# EAGLE design komblinkin (EAGLE 6.6.0)
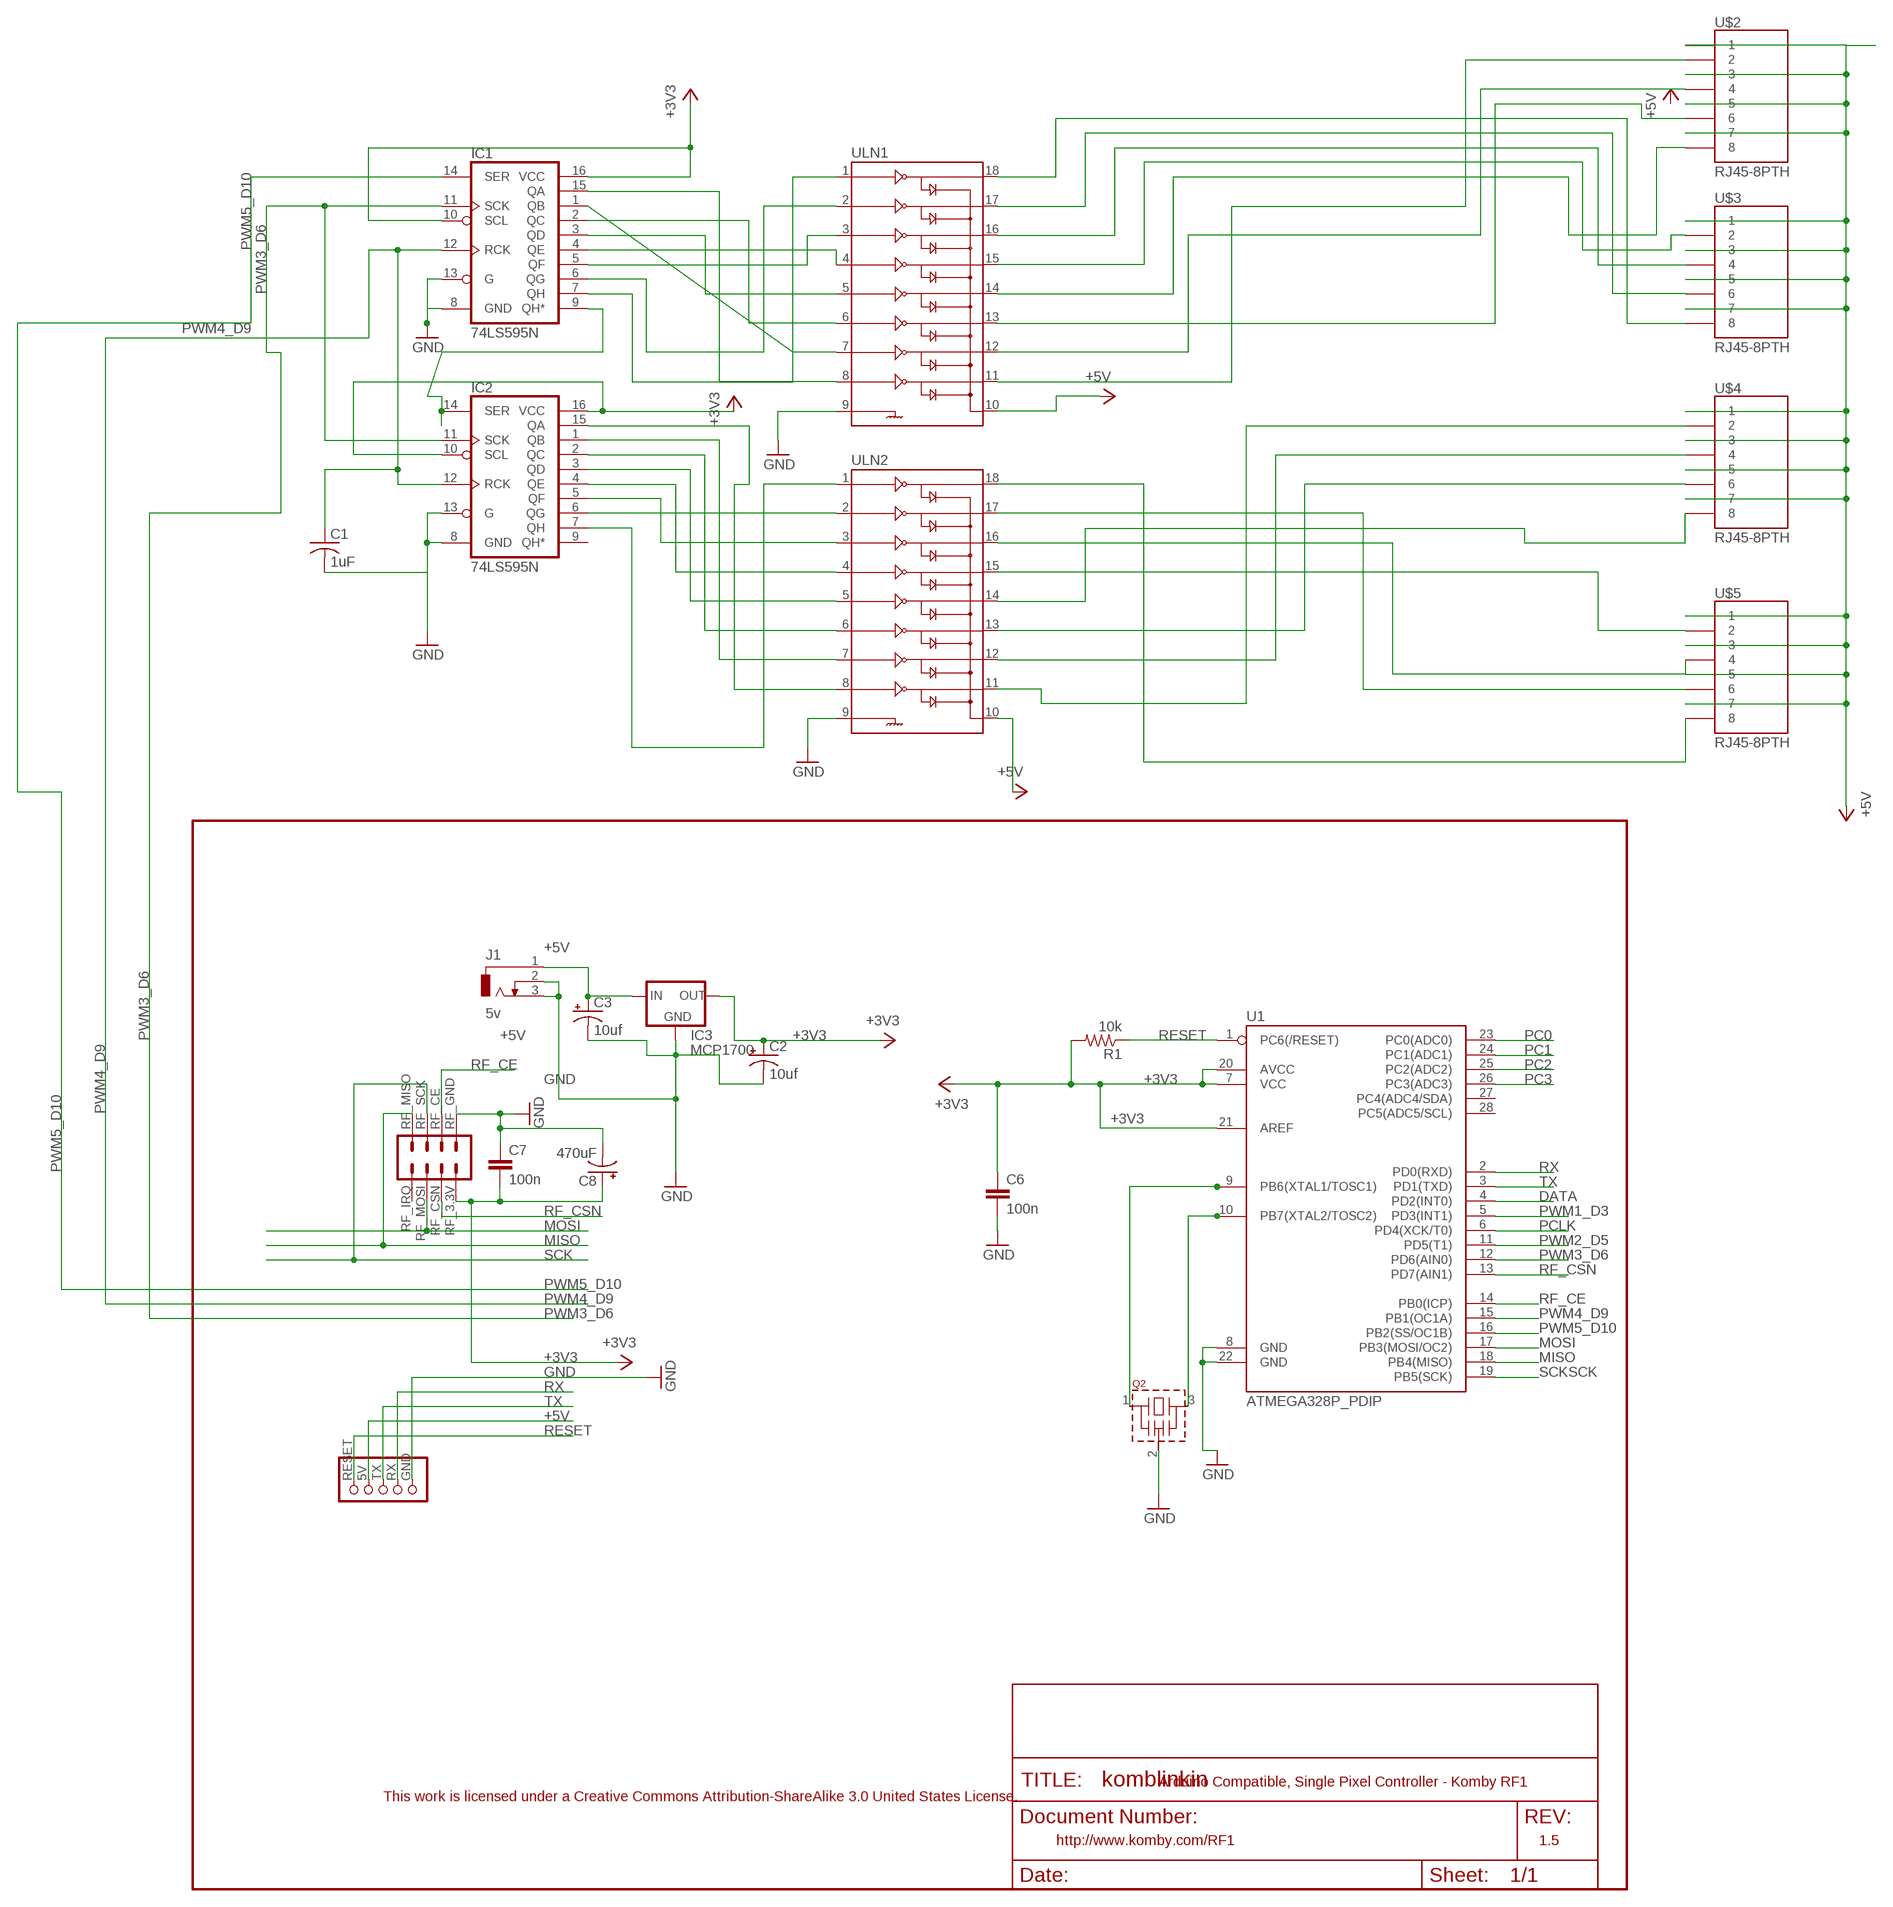
[diagram p0: schematic, sheet 1]

## Parts
C1  1uF  C-US050-025X075  [C050-025X075]
C2  10uf  CPOL-USE1.8-4  [E1,8-4]
C3  10uf  CPOL-USE5-8.5  [E5-8,5]
C6  100n  C-EU025-024X044  [C025-024X044]
C7  100n  C-EU025-024X044  [C025-024X044]
C8  470uF  CPOL-USE5-8.5  [E5-8,5]
IC1  74LS595N  [DIL16]
IC2  74LS595N  [DIL16]
IC3  MCP1700  MCP1700TRI  [TO92]
J1  5v  DCJ0303  [DCJ0303]
Q2  CSTLS_X  [CSTLS_X]
R1  10k  R-US_0207/7  [0207/7]
U1  ATMEGA328P_PDIP  [DIL28-3]
U$1  KOMBY_TTL_SERIAL  [KOMBY_SERIAL_FOOTPRINT]
U$2  RJ45-8PTH  [RJ45-8]
U$3  RJ45-8PTH  [RJ45-8]
U$4  RJ45-8PTH  [RJ45-8]
U$5  RJ45-8PTH  [RJ45-8]
U$8  NRF24L01_HEADER  [NRF24L01]
ULN1  ULN2803DIP  [DIL18]
ULN2  ULN2803DIP  [DIL18]

## Nets
+3V3: C2.+ C6.1 C7.2 C8.+ IC1.10(SCL) IC1.16(VCC) IC2.10(SCL) IC2.16(VCC) IC3.3(OUT) R1.2 U1.7(VCC) U1.20(AVCC) U1.21(AREF) U$8.RF_3.3V
+5V: C3.+ IC3.2(IN) J1.1 U$1.5V U$2.1 U$2.3 U$2.5 U$2.7 U$3.1 U$3.3 U$3.5 U$3.7 U$4.1 U$4.3 U$4.5 U$4.7 U$5.1 U$5.3 U$5.5 U$5.7 ULN1.10 ULN2.10
DATA: U1.4(PD2(INT0))
GND: C1.2 C2.- C3.- C6.2 C7.1 C8.- IC1.8(GND) IC1.13(G) IC2.8(GND) IC2.13(G) IC3.1(GND) J1.2 J1.3 Q2.2(VSS) U1.8(GND) U1.22(GND) U$1.GND U$8.RF_GND(RFGND_1) ULN1.9 ULN2.9
MISO: U1.18(PB4(MISO)) U$8.RF_MISO
MOSI: U1.17(PB3(MOSI/OC2)) U$8.RF_MOSI
N$1: U$5.8 ULN2.18
N$5: IC1.15(QA) ULN1.8
N$6: IC1.1(QB) ULN1.7
N$7: U$3.8 ULN1.18
N$8: IC1.2(QC) ULN1.6
N$9: IC1.3(QD) ULN1.5
N$10: IC1.4(QE) ULN1.4
N$11: IC1.5(QF) ULN1.3
N$12: IC1.9(QH*) IC2.14(SER)
N$13: IC1.6(QG) ULN1.2
N$14: U$3.6 ULN1.17
N$15: IC1.7(QH) ULN1.1
N$16: Q2.3 U1.10(PB7(XTAL2/TOSC2))
N$17: IC2.1(QB) ULN2.7
N$18: IC2.2(QC) ULN2.6
N$19: U$3.4 ULN1.16
N$20: IC2.3(QD) ULN2.5
N$21: IC2.4(QE) ULN2.4
N$22: IC2.5(QF) ULN2.3
N$23: IC2.6(QG) ULN2.2
N$24: IC2.7(QH) ULN2.1
N$25: U$3.2 ULN1.15
N$26: U$5.6 ULN2.17
N$27: U$5.4 ULN2.16
N$28: U$5.2 ULN2.15
N$29: U$4.8 ULN2.14
N$30: U$4.6 ULN2.13
N$31: U$4.4 ULN2.12
N$32: U$4.2 ULN2.11
N$33: IC2.15(QA) ULN2.8
N$34: Q2.1 U1.9(PB6(XTAL1/TOSC1))
N$35: U$2.8 ULN1.14
N$36: U$2.6 ULN1.13
N$37: U$2.4 ULN1.12
N$38: U$2.2 ULN1.11
PC0: U1.23(PC0(ADC0))
PC1: U1.24(PC1(ADC1))
PC2: U1.25(PC2(ADC2))
PC3: U1.26(PC3(ADC3))
PCLK: U1.6(PD4(XCK/T0))
PWM1_D3: U1.5(PD3(INT1))
PWM2_D5: U1.11(PD5(T1))
PWM3_D6: IC1.11(SCK) IC2.11(SCK) U1.12(PD6(AIN0))
PWM4_D9: C1.1 IC1.12(RCK) IC2.12(RCK) U1.15(PB1(OC1A))
PWM5_D10: IC1.14(SER) U1.16(PB2(SS/OC1B))
RESET: R1.1 U1.1(PC6(/RESET)) U$1.RESET
RF_CE: U1.14(PB0(ICP)) U$8.RF_CE
RF_CSN: U1.13(PD7(AIN1)) U$8.RF_CSN
RX: U1.2(PD0(RXD)) U$1.RX
SCK: U1.19(PB5(SCK)) U$8.RF_SCK
TX: U1.3(PD1(TXD)) U$1.TX
Unconnected: IC2.9(QH*) U1.27(PC4(ADC4/SDA)) U1.28(PC5(ADC5/SCL)) U$8.RF_IRQ

## Notes on the sheet
- Arduino Compatible, Single Pixel Controller - Komby RF1
- This work is licensed under a Creative Commons Attribution-ShareAlike 3.0 United States License.
- http://www.komby.com/RF1 | 1.5

## Library data of the parts
C1 = adafruit:C-US: CAPACITOR, American symbol
C2 C3 C8 = adafruit:CPOL-US: POLARIZED CAPACITOR, American symbol
C6 C7 = resistor:C-EU: CAPACITOR, European symbol
IC1 IC2 = SparkFun-DigitalIC:74*595: 8-bit SHIFT REGISTER, output latch
IC3 = adafruit:MCP1700: VOLTAGE REGULATOR
J1 = con-jack_komby:DCJ0303: DC POWER JACK Source: DCJ0303.pdf; OC_FARNELL: unknown; OC_NEWARK: unknown
Q2 = murata-resonators:CSTLS_X: Ceramic resonator 16.00 to 70.00 MHz
R1 = adafruit:R-US_: RESISTOR, American symbol
U1 = SparkFun-DigitalIC:ATMEGA328P_PDIP: uC used in the Arduino 32kb flash, 1k EEPROM, 2k SRAM This is the through-hole version of this chip.
U$1 = komby1:KOMBY_TTL_SERIAL
U$2-U$5 = SparkFun-Connectors:RJ45-8: RJ45 Jack Simple RJ45, 8-pin connection - connector for common Cat5, Cat5e, and Cat6 Ethernet cables. Footprint not yet proven in production. Connector sku is PRT-00643; Breakout PCB sku is BOB-00716.
U$8 = komby1:NRF24L01_HEADER: Header for the NRF24L01 8 Pin Transceivers. http://www.komby.com
ULN1 ULN2 = SparkFun-PowerIC:ULN2803: Darlington Driver ULN2803 Darlington array. 500mA max per channel, 8-channel package. Spark Fun Electronics SKU : COM-00312

## Net classes
0 default: width 0.203 mm
1 vcc: width 0.305 mm

## Board
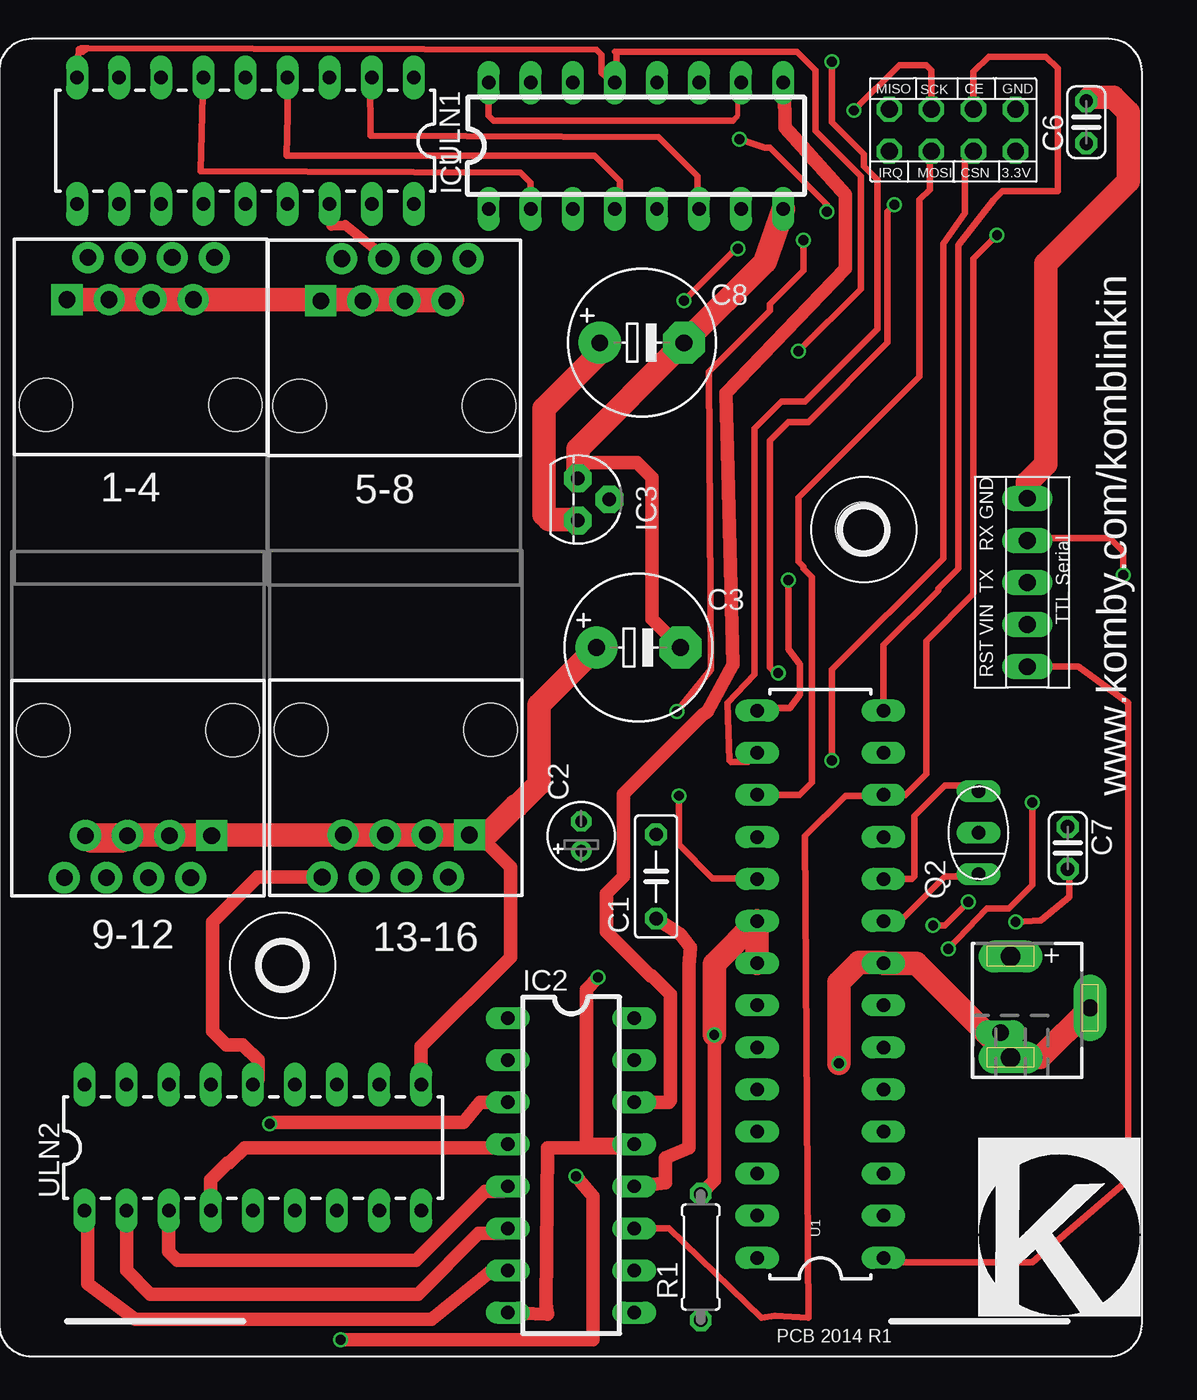
[diagram p1: board, top side]
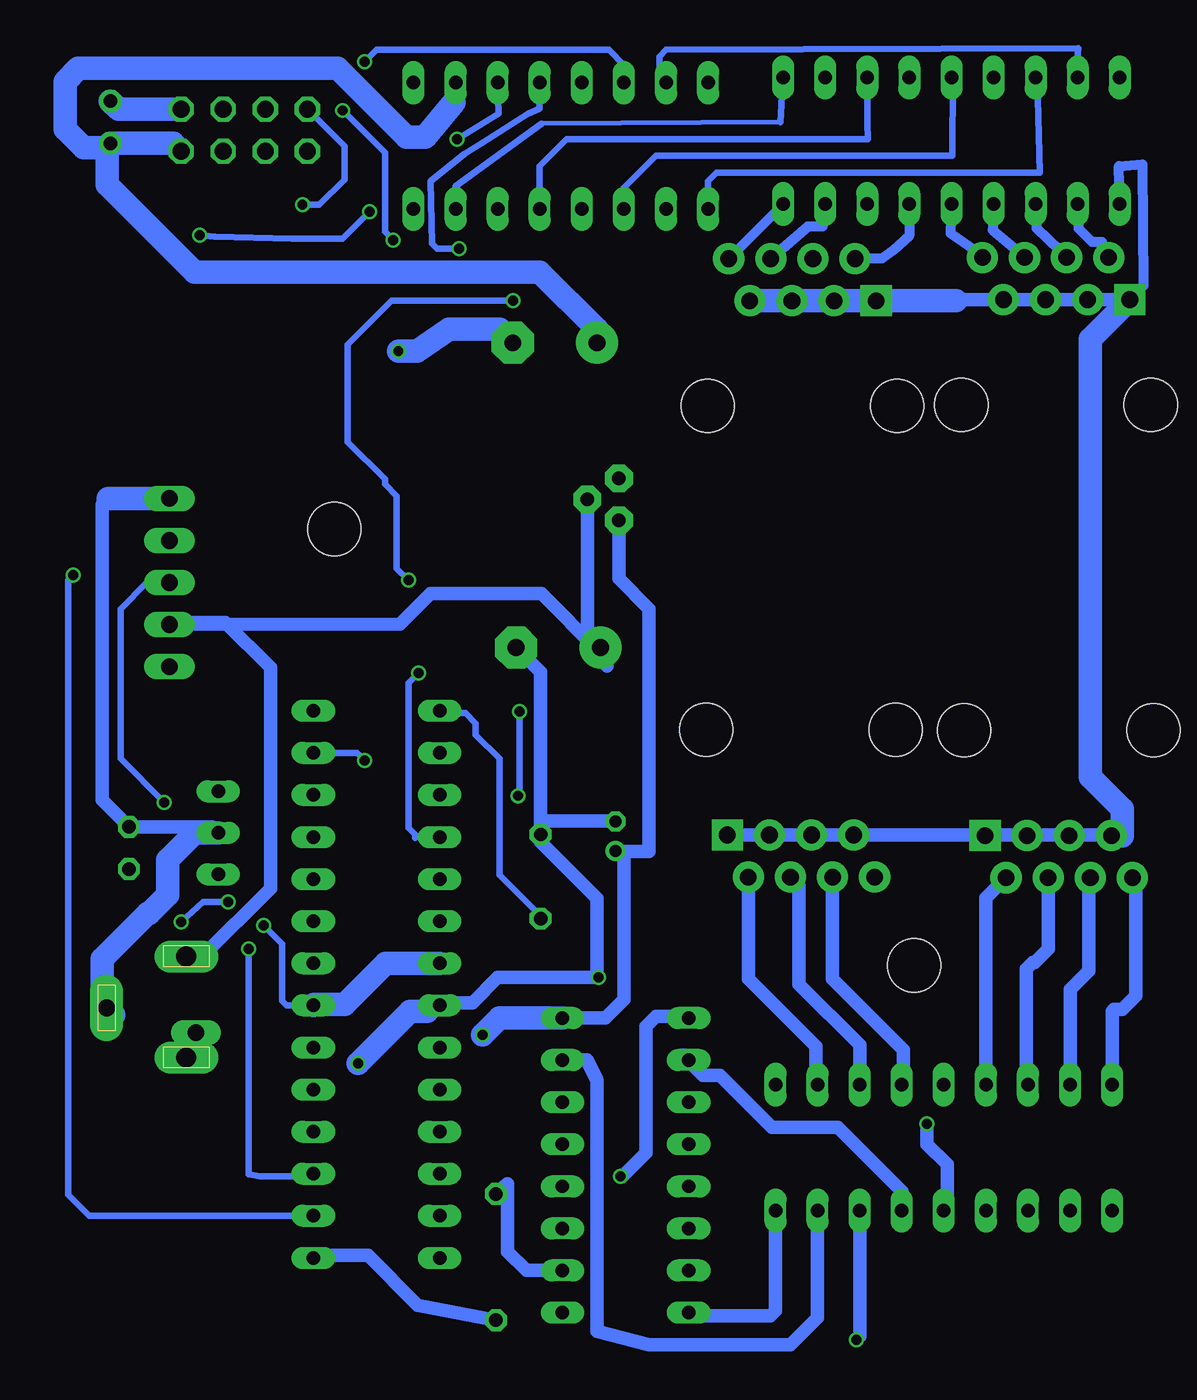
[diagram p2: board, bottom side, seen from below]

No outline drawn. Coordinates in mm, seen from the top.
Copper layers (1*16): Top 0.035mm / dielectric 1.5mm / Bottom 0.035mm
Design rules "Fusion_eagle_rule_v1.1": minimum track width 6mil, minimum drill 12mil, track to track 6mil, track to pad 6mil, pad to pad 6mil, via to via 6mil, smd to smd 0mil, copper to edge 10mil, drill to drill 10mil, minimum pad ring 10mil, minimum via ring 6mil, stop-mask expansion 2mil, vias tented up to drill 100mil, thermal gap 10mil

### Footprints (pad centres in the part's own frame; a part is rotated, then mirrored left to right if it is on the bottom)
C050-025X075 = drill 0.813 octagon: 1 -2.54,0; 2 2.54,0
E1,8-4 = drill 0.711 pad 1.168: + -0.889,0 | drill 0.711 pad 1.168 octagon: - 0.889,0
E5-8,5 = drill 1.016 pad 2.54: + -2.54,0 | drill 1.016 pad 2.54 octagon: - 2.54,0
C025-024X044 = drill 0.813 octagon: 1 -1.27,0; 2 1.27,0
DIL16 = drill 0.813 long: 1 -8.89,-3.81; 2 -6.35,-3.81; 3 -3.81,-3.81; 4 -1.27,-3.81; 5 1.27,-3.81; 6 3.81,-3.81; 7 6.35,-3.81; 8 8.89,-3.81; 9 8.89,3.81; 10 6.35,3.81; 11 3.81,3.81; 12 1.27,3.81; 13 -1.27,3.81; 14 -3.81,3.81; 15 -6.35,3.81; 16 -8.89,3.81
TO92 = drill 0.813 pad 1.676 octagon: 1 -1.27,0; 2 0,1.905; 3 1.27,0
DCJ0303 = drill 1.2 pad 1.93 long: 1 0,3.1; 3 0,-3 | drill 1 pad 2 long: 2 4.8,0 | drill 1 long: P$1 -0.589,-1.501
CSTLS_X = drill 0.813 long: 1 -2.5,0; 2 0,0; 3 2.5,0
0207/7 = drill 0.813 octagon: 1 -3.81,0; 2 3.81,0
DIL28-3 = drill 0.813 long: 1 -16.51,-3.81; 2 -13.97,-3.81; 3 -11.43,-3.81; 4 -8.89,-3.81; 5 -6.35,-3.81; 6 -3.81,-3.81; 7 -1.27,-3.81; 8 1.27,-3.81; 9 3.81,-3.81; 10 6.35,-3.81; 11 8.89,-3.81; 12 11.43,-3.81; 13 13.97,-3.81; 14 16.51,-3.81; 15 16.51,3.81; 16 13.97,3.81; 17 11.43,3.81; 18 8.89,3.81; 19 6.35,3.81; 20 3.81,3.81; 21 1.27,3.81; 22 -1.27,3.81; 23 -3.81,3.81; 24 -6.35,3.81; 25 -8.89,3.81; 26 -11.43,3.81; 27 -13.97,3.81; 28 -16.51,3.81
KOMBY_SERIAL_FOOTPRINT = drill 1.016 long: 5V 3.25,3.925; GND 3.25,11.545; RESET 3.25,1.385; RX 3.25,9.005; TX 3.25,6.465
RJ45-8 = drill 1 pad 1.88 square: 1 -4.445,6.35 | drill 1 pad 1.88: 2 -3.175,8.89; 3 -1.905,6.35; 4 -0.635,8.89; 5 0.635,6.35; 6 1.905,8.89; 7 3.175,6.35; 8 4.445,8.89 | hole 3.2: -5.715,0; 5.715,0
TA200FTPRNT = hole 3.2: 52.126,49.918; 17.128,23.595
NRF24L01 = drill 1.016 octagon: RF_3.3V 2.54,-0.635; RF_CE 0,1.905; RF_CSN 0,-0.635; RF_GND 2.54,1.905; RF_IRQ -5.08,-0.635; RF_MISO -5.08,1.905; RF_MOSI -2.54,-0.635; RF_SCK -2.54,1.905
DIL18 = drill 0.813 long: 1 -10.16,-3.81; 2 -7.62,-3.81; 3 -5.08,-3.81; 4 -2.54,-3.81; 5 0,-3.81; 6 2.54,-3.81; 7 5.08,-3.81; 8 7.62,-3.81; 9 10.16,-3.81; 10 10.16,3.81; 11 7.62,3.81; 12 5.08,3.81; 13 2.54,3.81; 14 0,3.81; 15 -2.54,3.81; 16 -5.08,3.81; 17 -7.62,3.81; 18 -10.16,3.81

### Placement (x,y rotation side)
C1  39.78,28.85 90 top
C2  35.26,31.29 90 top
C3  38.71,42.67 0 top
C6  65.74,74.37 90 top
C7  64.62,30.58 270 top
C8  38.91,61.06 0 top
IC1  38.56,72.95 0 top
IC2  34.65,11.43 270 top
IC3  35.05,51.61 270 top
J1  61.16,20.93 0 top
Q2  59.23,31.5 90 top
R1  42.47,5.89 90 top
U1  49.68,22.35 90 top
U$1  58.93,40.13 0 top
U$2  8.67,57.31 0 top
U$3  23.98,57.25 0 top
U$4  24.06,37.71 180 top
U$5  8.51,37.67 180 top
U$6  [TA200FTPRNT]  0.1,-0.1 0 top
U$7  [KOMBY_LOGO_1CMX1CM]  59.23,2.34 0 top
U$8  58.93,73.25 0 top
ULN1  14.99,73.25 180 top
ULN2  15.44,12.5 0 top

### Tracks (layer width: path | path; a pad name or v marks a point on that pad's centre or on a via)
+3V3  (via drill 0.6)
  Top 0.305: 44.4,74.47 44.7,74.78 44.7,76.56
  Top 0.406: IC1.16 29.67,74.78 29.97,74.47 44.4,74.47 | 44.7,76.56 IC1.10 | v56.49,25.91 57.2,25.91 v58.62,27.33 | v61.47,26.11 62.99,26.21 64.72,27.64 64.72,29.21 C7.2
  Top 0.813: 33.02,50.7 33.33,50.39 | 35,50.39 IC3.3 | v43.28,19.3 43.28,10.52 R1.2
  Top 1.422: C8.+ 36.37,60.45 33.02,57.1 33.02,50.7 | 33.33,50.39 35,50.39 | U1.21 U1.20 43.28,23.57 v43.28,19.3
  Bottom 0.406: IC1.10 45.01,75.59 | 65.99,72.85 C6.1 | U1.7 55.12,21.08 55.37,21.34 55.37,24.79 v56.49,25.91 | v58.62,27.33 60.15,27.33 v61.47,26.11
  Bottom 0.813: IC3.3 35.05,46.84 33.22,45.01 33.22,30.38 35.23,30.38 C2.+ 34.75,29.9 34.75,21.44 35.87,20.32 IC2.16 | IC2.10 40.64,5.08 41.76,6.2 41.76,10.31 R1.2
  Bottom 1.422: 45.01,75.59 46.74,73.46 47.85,73.46 52.02,77.62 67.67,77.62 68.48,76.81 68.48,73.97 67.36,72.85 65.99,72.85 | U$8.RF_3.3V 61.95,73.1 C6.1 65.94,72.9 65.94,70.61 60.66,65.33 39.83,65.33 36.37,61.87 C8.+ | IC2.16 42.27,20.32 v43.28,19.3 | U1.21 49.12,23.62 51.61,21.13 53.44,21.13 U1.7
+5V
  Top 0.813: U$2.1 U$2.3 | 27.5,63.66 27.53,63.7 21.97,63.7 | U$3.1 19.63,63.7 21.97,63.7 | 21.97,63.7 U$3.3 | 4.1,63.66 4.06,63.7 | 5.11,31.36 4.88,31.6 5.06,31.6 U$5.7 5.35,31.32 5.69,30.99 | 7.54,30.99 U$5.5 U$5.3 | U$5.3 11.25,31.32 11.38,31.19 12.82,31.19 U$5.1 | U$4.1 29.06,31.36 | 29.06,31.36 29.53,31.36 | 31.29,33.12 31.39,33.12 | U$5.3 12.05,31.32 12.09,31.36 | ULN2.10 25.6,18.59 30.99,23.98 30.99,29.43 29.06,31.36
  Top 1.422: 27.5,63.66 U$2.7 U$2.5 U$2.3 4.1,63.66 | U$3.5 U$3.7 | U$4.1 U$4.3 U$4.5 U$4.7 12.09,31.36 5.11,31.36 | 5.69,30.99 7.54,30.99 | 29.53,31.36 31.29,33.12 | 31.39,33.12 32.72,34.44 32.72,39.22 C3.+
  Bottom 0.61: ULN1.10 4.88,71.73 3.45,71.83 3.4,64.48 U$2.1
  Bottom 0.813: U$2.1 14.67,63.66 14.73,63.6 | U$4.1 4.74,31.36 4.67,31.29 | IC3.2 36.96,42.75 36.27,42.06 | 36.27,42.06 35.76,41.55 35.76,42.27 C3.+ | J1.1 60.2,24.03 56.08,28.14 56.08,41.45 58.83,44.2 62.04,44.2 U$1.5V 48.26,44.09 46.43,45.92 39.73,45.92 36.27,42.47 36.27,42.06
  Bottom 1.422: 14.73,63.6 U$3.7 | 4.67,31.29 4.67,32.92 6.6,34.85 6.6,61.28 U$2.1
GND  (via drill 0.6)
  Top 0.406: ULN1.9 4.93,78.79 5.18,78.64 5.49,78.84 5.08,78.84 36.17,78.74 36.47,78.44 36.47,77.37 IC1.13 37.29,76.61 37.39,76.5 37.39,78.54 37.29,78.64 48.26,78.64 49.38,77.52 49.38,73.86 52.12,71.12 52.12,64.31 v48.36,60.55 | 42.27,61.87 C8.- | 63.3,53.65 63.3,53.75 | 65.99,75.89 C6.2
  Top 0.813: IC2.8 33.22,2.44 33.12,3.05 33.22,12.5 38.25,12.5 IC2.13 35.66,12.7 35.56,12.6 35.56,22.05 v36.27,22.76 | 35.05,53.75 35.15,53.85 38.61,53.85 39.52,52.93 39.52,44.4 C3.-
  Top 1.422: IC1.8 46.33,65.94 C8.- 35.05,54.66 IC3.1 35.05,53.75 | 65.99,75.89 67.36,75.89 68.28,74.98 68.28,70.81 63.3,65.84 63.3,53.75 62.18,52.63 U$1.GND | v50.8,17.58 50.8,22.45 52.02,23.67 53.44,23.67 U1.8 55.47,23.62 J1.3 62.96,17.93 J1.2
  Bottom 0.813: 65.87,51.68 66.24,51.31 66.24,33.48 C7.1 59.59,31.85 Q2.2 | C2.- arc-90 35.28,32.21 39.42,32.21 arc-90 39.78,31.85 C1.2 | C1.2 39.78,41.2 C3.- | ULN2.9 25.6,2.64 25.91,2.34 30.63,2.34 IC2.8 | U1.22 46.23,20.73 46.63,20.73 46.13,21.23 43.89,21.23 42.37,22.76 v36.27,22.76 36.37,22.86 36.37,27.53 39.78,30.94 C1.2
  Bottom 1.422: U$1.GND 65.87,51.68 | v48.36,60.55 47.24,60.55 45.31,61.87 42.27,61.87 C8.- | U$8.RF_GND 65.25,75.16 C6.2 | 46.63,20.73 47.65,20.73 v50.8,17.58 | Q2.2 60.66,31.5 62.28,29.87 62.28,27.74 63.4,26.62 63.5,26.62 66.24,23.88 66.24,21.21 J1.2 65.54,20.51
MISO  (via drill 0.6)
  Top 0.406: v47.14,41.15 46.94,41.15 46.63,41.45 46.63,55.17 47.75,56.29 48.97,56.29 53.75,61.06 53.75,68.99 v54.15,69.39
  Bottom 0.406: U1.18 47.3,31.24 47.35,31.19 47.35,31.39 47.75,31.8 47.75,40.54 v47.14,41.15 | v54.15,69.39 53.14,69.39 51.61,70.92 51.61,72.92 U$8.RF_MISO
MOSI
  Top 0.406: U1.17 48.41,33.78 49.17,34.54 49.17,46.94 48.67,47.45 48.67,47.55 48.36,47.85 48.36,51.71 55.68,59.03 55.68,69.7 56.29,70.31 56.29,72.52 U$8.RF_MOSI
N$1
  Bottom 0.813: U$5.8 3.86,28.58 3.86,21.64 4.67,20.83 5.18,20.83 5.28,20.73 ULN2.18
N$5
  Bottom 0.406: ULN1.8 7.37,78.49 7.32,78.84 32.21,78.74 32.61,78.33 32.61,77.17 IC1.15
N$6
  Bottom 0.305: ULN1.7 9.8,76.96
  Bottom 0.406: 9.8,76.96 9.65,71.32 29.16,71.32 29.67,70.81 IC1.1
N$7
  Bottom 0.61: ULN1.18 24.92,69.65 U$3.8
N$8
  Top 0.305: ULN1.6 12.45,77.17
  Top 0.406: 12.45,77.17 12.29,71.42 31.6,71.32 32.21,70.71 IC1.2
N$9
  Bottom 0.305: ULN1.5 14.88,77.06
  Bottom 0.406: 14.88,77.06 14.94,72.34 32.82,72.34 34.75,70.41 IC1.3
N$10
  Top 0.406: ULN1.4 17.53,74.83 17.48,72.34 36.07,72.34 37.59,70.81 37.59,69.44 IC1.4
N$11
  Bottom 0.406: ULN1.3 20.07,74.32 20.02,73.36 38.2,73.36 39.83,71.73 IC1.5
N$12
  Top 0.813: IC2.14 40.54,15.24 40.64,15.34 40.64,21.74 39.52,22.86 39.42,22.86 36.78,25.5 36.78,27.84 37.8,28.85 37.8,33.83 42.57,38.61 42.88,38.81 44.4,41.66 43.99,58.01 51.21,65.53 51.21,70 47.55,74.07 47.55,74.93 IC1.9
N$13
  Top 0.305: ULN1.2 22.5,76.96
  Top 0.406: 22.5,76.96 22.55,73.56 39.93,73.46 42.27,71.12 42.27,69.24 IC1.6
N$14
  Bottom 0.61: ULN1.17 22.81,68.63 22.76,68.07 23.65,68.07 U$3.6
N$15
  Bottom 0.305: 25.3,74.37 39.73,74.27
  Bottom 0.406: ULN1.1 25.3,74.37 | 39.73,74.27 44.91,70.51 44.81,69.44 IC1.7
N$16
  Top 0.406: U1.10 55.22,28.7 55.37,28.85 55.37,32.51 57.2,34.34 58.89,34.34 Q2.3
N$17  (via drill 0.6)
  Top 0.813: v20.73,0.91 35.97,0.91 35.97,9.55 v34.95,10.77
  Bottom 0.813: ULN2.7 20.52,1.12 v20.73,0.91 | v34.95,10.77 34.85,10.77 33.43,12.19 33.43,19.81 32.82,20.42 30.94,20.42 IC2.1
N$18
  Bottom 0.813: ULN2.6 17.98,9.86 21.84,13.72 25.81,13.72 28.96,16.87 29.97,16.87 31.19,18.09 31.14,18.09 IC2.2
N$19
  Top 0.61: ULN1.16 20.17,68.12 21.03,68.17 23.55,66.14 U$3.4
N$20  (via drill 0.6)
  Top 0.813: IC2.3 29.16,15.24 28.14,14.02 16.76,14.02 v16.46,13.92
  Bottom 0.813: v16.46,13.92 16.46,12.7 15.24,11.48 15.24,8.89 ULN2.5
N$21
  Top 0.813: ULN2.4 12.9,10.57 13.92,11.58 14.02,11.58 14.94,12.5 30.63,12.5 IC2.4
N$22
  Top 0.813: ULN2.3 10.36,6.2 10.87,5.69 25.3,5.69 29.46,9.86 30.53,9.86 IC2.5
N$23
  Top 0.813: ULN2.2 7.82,5.08 9.25,3.66 25.4,3.66 29.06,7.32 30.53,7.32 IC2.6
N$24
  Top 0.813: IC2.7 29.87,5.08 26.21,2.13 8.33,2.13 5.49,4.27 5.49,8.48 ULN2.1
N$25
  Bottom 0.61: ULN1.15 17.53,67.51 18.49,66.65 19.18,66.14 U$3.2
N$26
  Bottom 0.813: ULN2.17 7.82,22.05 6.71,23.16 6.71,28.68 U$5.6
N$27
  Bottom 0.813: U$5.4 9.14,24.48 9.96,23.67 10.06,23.67 10.46,23.27 10.46,16.41 ULN2.16
N$28
  Bottom 0.813: ULN2.15 12.9,27.57 U$5.2
N$29
  Top 0.813: U$4.8 15.72,28.82 13.01,26.11 13.01,19.51 13.82,18.69 14.83,18.69 15.75,17.78 15.75,16.61 ULN2.14
N$30
  Bottom 0.813: U$4.6 22.16,22.67 17.88,18.39 17.88,16.41 ULN2.13
N$31
  Bottom 0.813: ULN2.12 20.52,18.69 24.18,22.35 24.18,28.3 U$4.4
N$32
  Bottom 0.813: U$4.2 27.24,22.67 23.16,18.59 23.16,16.41 ULN2.11
N$33
  Bottom 0.813: ULN2.8 23.06,2.23 24.69,0.61 33.22,0.61 36.37,1.42 36.37,16.56 36.98,17.78 IC2.15
N$34
  Top 0.406: U1.9 54.51,26.16 57.2,28.85 59.09,28.85 Q2.1
N$35
  Bottom 0.61: ULN1.14 15.04,67.67 13.56,66.66 U$2.8
N$36
  Bottom 0.61: ULN1.13 12.5,67.87 11.02,66.66 U$2.6
N$37
  Bottom 0.61: ULN1.12 9.86,67.97 8.48,66.66 8.24,66.66 8.13,66.55 8.13,66.24 8.03,66.34 8.03,66.14 U$2.4
N$38
  Bottom 0.61: ULN1.11 7.32,67.97 6.5,67.16 5.89,67.16 5.94,67.11 5.94,66.66 U$2.2
PWM3_D6  (via drill 0.6)
  Top 0.406: U1.12 54.05,33.78 | 54.05,33.78 54.81,33.78 56.08,35.05 56.08,43.08 58.93,45.92 58.93,66.14 v60.35,67.56 | v50.09,68.99 50.09,69.39 46.63,72.85 46.33,72.85 v44.81,73.36 | IC2.11 40.54,7.62 46.13,2.23 46.94,2.34 48.97,2.23 48.77,31.29 51.21,33.73 54,33.73 54.05,33.78
  Bottom 0.406: v60.35,67.56 59.44,67.46 54.76,67.36 51.71,67.36 v50.09,68.99 | v44.81,73.36 42.32,74.88 IC1.11
PWM4_D9  (via drill 0.6)
  Top 0.406: v44.7,66.75 44.6,66.75 v41.45,63.6 | v47.75,46.74 47.75,42.57 48.46,41.66 48.46,39.83 47.85,39.01 46.02,39.01 U1.15
  Top 0.813: IC2.12 38.61,10.16 40.34,10.36 40.34,11.89 41.76,12.5 41.76,23.47 41.86,24.59 41.25,25.35 C1.1
  Bottom 0.406: C1.1 39.78,26.47 42.27,28.96 42.27,35.97 43.69,37.39 43.69,38.1 44.3,38.71 45.72,38.71 U1.15 | IC1.12 39.83,75.18 40.54,74.88 43.28,73.15 44.4,72.44 46.43,70.81 46.33,67.06 46.02,66.75 v44.7,66.75 | v41.45,63.6 48.77,63.6 51.41,60.96 51.41,55.07 49.17,52.83 49.17,52.53 48.46,51.82 48.46,47.45 v47.75,46.74
PWM5_D10  (via drill 0.6)
  Top 0.406: v50.39,78.03 50.39,74.37 52.32,72.44 52.32,71.73 53.14,70.92 53.14,61.87 48.77,57.51 47.35,57.51 45.72,55.88 45.72,41.05 44.09,39.32 44.2,35.87 44.3,35.76 45.31,35.76 U1.16
  Bottom 0.406: IC1.14 34.75,77.83 35.66,78.74 49.68,78.74 v50.39,78.03
RESET
  Top 0.406: U$1.RESET 65.27,41.52 68.28,39.32 68.28,10.57 62.48,5.59 53.75,5.59 U1.1
  Bottom 0.813: R1.1 47.19,3 50.19,5.99 53.34,5.99 U1.1
RF_CE
  Top 0.406: U1.14 53.49,42.82 56.79,46.13 56.79,46.23 58.01,47.45 58.01,66.95 60.15,69.7 60.66,70.21 64.01,70.21 64.01,77.62 63.3,78.33 59.84,78.33 58.93,77.42 U$8.RF_CE
RF_CSN  (via drill 0.6)
  Top 0.406: v50.39,35.87 50.39,41.35 57.1,48.06 57.1,67.06 58.42,68.89 58.42,72.11 U$8.RF_CSN
  Bottom 0.406: U1.13 50.85,36.32 v50.39,35.87
RX  (via drill 0.6)
  Top 0.406: v67.97,47.04 67.97,48.46 67.16,49.28 62.32,49.28 U$1.RX
  Bottom 0.406: U1.2 67,8.38 68.28,9.65 68.28,46.74 v67.97,47.04
SCK  (via drill 0.6)
  Top 0.406: U$8.RF_SCK 56.39,77.52 56.08,77.83 54.46,77.83 v51.71,75.08 | v48.67,67.26 48.67,65.43 46.63,63.4 46.63,62.99 42.98,59.33 43.08,41.35 v41.05,38.81 | v41.15,33.73 41.15,30.79 43.18,28.75 46.13,28.75 46.33,28.96 46.13,28.96 U1.19
  Bottom 0.406: v51.71,75.08 49.17,72.54 49.17,67.77 v48.67,67.26 | v41.05,38.81 41.05,33.83 v41.15,33.73
TX  (via drill 0.6)
  Top 0.406: v62.48,33.33 62.48,28.35 61.06,26.92 59.74,26.92 v57.4,24.49
  Bottom 0.406: U$1.TX 63.54,46.6 65.13,45.01 65.13,35.97 v62.48,33.33 | v57.4,24.49 57.4,10.87 56.69,10.77 53.65,10.77 U1.3

### Text on the board
tNames: 1-4 | 5-8 | www.komby.com/komblinkin | 13-16 | 9-12 | PCB 2014 R1